# EAGLE schematic bariera (EAGLE 7.5.0)
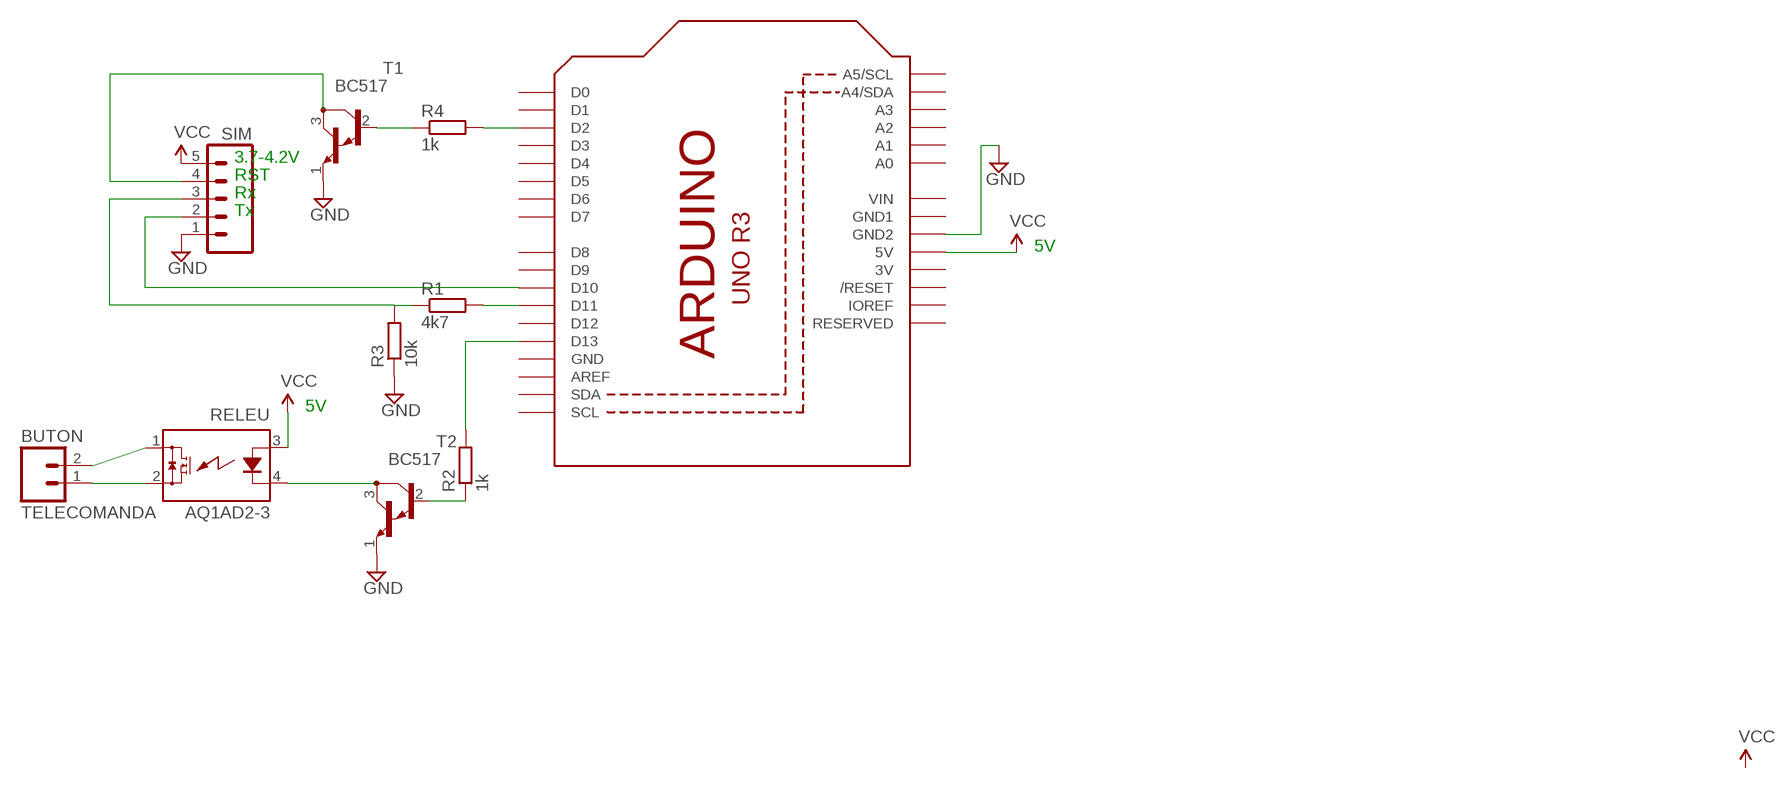
[diagram p0: schematic, sheet 1]

## Parts
BUTON  TELECOMANDA  M02PTH  [1X02]
R1  4k7  R-EU_0207/5V  [0207/5V]
R2  1k  R-EU_0207/5V  [0207/5V]
R3  10k  R-EU_0207/5V  [0207/5V]
R4  1k  R-EU_0207/5V  [0207/5V]
RELEU  AQ1AD2-3  [AQ1]
SIM  M05JST-VERT  [JST-5-PTH-VERT]
T1  BC517  [TO92]
T2  BC517  [TO92]
U1  ARDUINOR3-DIMENSION  [ARDUINOR3]

## Nets
GND: R3.1 SIM.1 T1.1(E) T2.1(E) U1.GND2
N$1: R4.2 U1.D2
N$2: R4.1 T1.2(B)
N$3: R2.2 U1.D13
N$4: R2.1 T2.2(B)
N$5: SIM.4 T1.3(C)
N$6: RELEU.4(K) T2.3(C)
N$7: BUTON.2 RELEU.1(DS1)
N$8: BUTON.1 RELEU.2(DS2)
N$10: R1.2 U1.D11
RX-SIM: SIM.2 U1.D10
TX-SIM: R1.1 R3.2 SIM.3
VCC: RELEU.3(A) SIM.5 U1.5V
Unconnected: U1.A0 U1.A1 U1.A2 U1.A3 U1.A4(A4/SDA) U1.A5(A5/SCL) U1.AREF U1.D0 U1.D1 U1.D3 U1.D4 U1.D5 U1.D6 U1.D7 U1.D8 U1.D9 U1.D12 U1.IOREF U1.RESERVED U1.RESET(/RESET) U1.SCL U1.SDA

## Notes on the sheet
- 3.7-4.2V
- RST
- Rx
- Tx
- 5V
- 5V

## Power pins joined to a net without a drawn wire
3V: U1.3V
GND: U1.GND
GND1: U1.GND1
VIN: U1.VIN

## Library data of the parts
BUTON = SparkFun-Connectors:M02: Standard 2-pin 0.1" header. Use with - straight break away headers ( PRT-00116) - right angle break away headers (PRT-00553) - swiss pins (PRT-00743) - machine pins (PRT-00117) - female headers (PRT-00115) Molex polarized connector foot print use with: PRT-08233 with associated crimp pins and housings. 2.54_SCREWTERM for use with PRT-10571. 3.5mm Screw Terminal footprints for PRT-08084 5mm Screw Terminal footprints for use with PRT-08432
R1-R4 = resistor:R-EU_: RESISTOR, European symbol
RELEU = relay:AQ*: SOLID STATE RELAY NAiS Source: http://www.mew-europe.com/.. en_ds_61601_0000.pdf; MF: AROMAT/ MATSUSHITA; MPN: AQ1AD2-3/28VDC; OC_FARNELL: unknown; OC_NEWARK: 10C4052
SIM = SparkFun-Connectors:M05: Header 5 Standard 5-pin 0.1" header. Use with straight break away headers (SKU : PRT-00116), right angle break away headers (PRT-00553), swiss pins (PRT-00743), machine pins (PRT-00117), and female headers (PRT-00115). Molex polarized connector foot print use with SKU : PRT-08230 with associated crimp pins and housings.
T1 T2 = transistor-neu-to92:BC517: NPN BIPOLAR DARLINGTON TRANSISTOR
U1 = adafruit:ARDUINOR3: This is a new object for the new Arduino R3 - with extra pins that you may want to use (such as IOref, and duplicated A4/A5